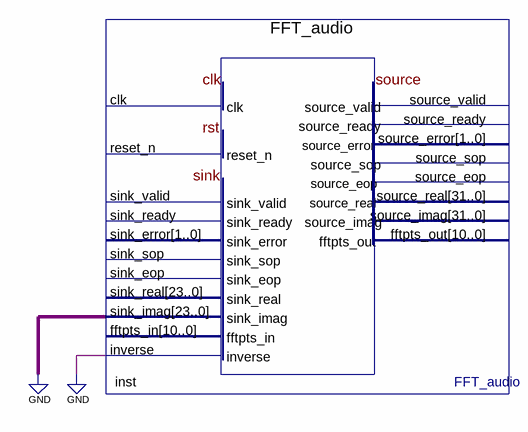
[diagram p0: schematic sheet]
// Quartus schematic FFT_diagram.bdf as structural Verilog: 1 symbols, 0 pins
module FFT_diagram (
);

  FFT_audio inst (
    .sink_imag({24{1'b0}}), .inverse(1'b0));  // open: clk, reset_n, sink_valid, sink_error, sink_sop, sink_eop, sink_real, fftpts_in, source_ready, sink_ready, source_valid, source_error, source_sop, source_eop, source_real, source_imag, fftpts_out
endmodule
